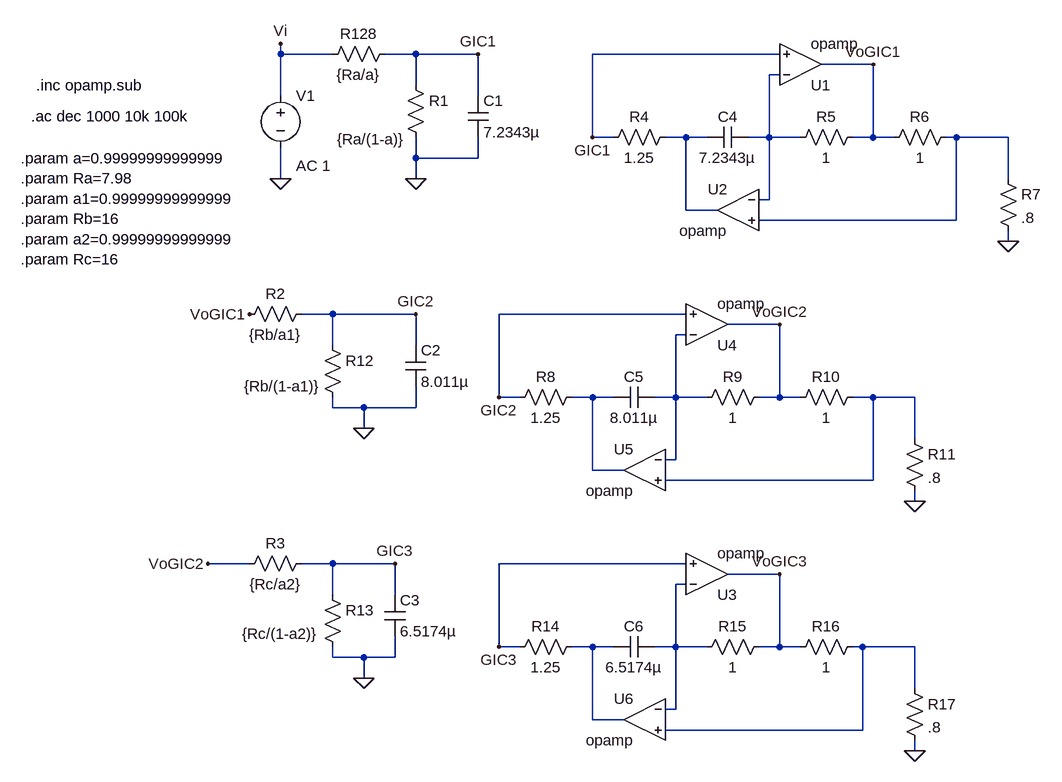
[diagram p0: schematic TS6_ACTIVADO.asc]
TS6_ACTIVADO.asc, the LTspice schematic file:
Version 4
SHEET 1 1540 1188
WIRE -112 96 -112 80
WIRE -32 96 -112 96
WIRE 96 96 48 96
WIRE 192 96 96 96
WIRE 656 96 368 96
WIRE 800 112 720 112
WIRE 656 128 640 128
WIRE 96 144 96 96
WIRE -112 160 -112 96
WIRE 192 160 192 96
WIRE 368 224 368 96
WIRE 400 224 368 224
WIRE 512 224 480 224
WIRE 544 224 512 224
WIRE 640 224 640 128
WIRE 640 224 608 224
WIRE 688 224 640 224
WIRE 800 224 800 112
WIRE 800 224 768 224
WIRE 832 224 800 224
WIRE 928 224 912 224
WIRE 1008 224 928 224
WIRE 96 256 96 224
WIRE 192 256 192 224
WIRE 192 256 96 256
WIRE -112 288 -112 240
WIRE 96 288 96 256
WIRE 1008 288 1008 224
WIRE 640 320 640 224
WIRE 640 320 624 320
WIRE 512 336 512 224
WIRE 560 336 512 336
WIRE 928 352 928 224
WIRE 928 352 624 352
WIRE 1008 384 1008 368
WIRE -32 496 -80 496
WIRE 96 496 -32 496
WIRE 512 496 224 496
WIRE 656 512 576 512
WIRE 512 528 496 528
WIRE -32 544 -32 496
WIRE 96 544 96 496
WIRE 224 624 224 496
WIRE 256 624 224 624
WIRE 368 624 336 624
WIRE 400 624 368 624
WIRE 496 624 496 528
WIRE 496 624 464 624
WIRE 544 624 496 624
WIRE 656 624 656 512
WIRE 656 624 624 624
WIRE 688 624 656 624
WIRE 800 624 768 624
WIRE 864 624 800 624
WIRE -32 640 -32 624
WIRE 16 640 -32 640
WIRE 96 640 96 608
WIRE 96 640 16 640
WIRE 16 672 16 640
WIRE 864 688 864 624
WIRE 496 720 496 624
WIRE 496 720 480 720
WIRE 368 736 368 624
WIRE 416 736 368 736
WIRE 800 752 800 624
WIRE 800 752 480 752
WIRE 864 784 864 768
WIRE -160 880 -224 880
WIRE -32 880 -80 880
WIRE 64 880 -32 880
WIRE 512 880 224 880
WIRE 656 896 576 896
WIRE 512 912 496 912
WIRE -32 928 -32 880
WIRE 64 928 64 880
WIRE 224 1008 224 880
WIRE 256 1008 224 1008
WIRE 368 1008 336 1008
WIRE 400 1008 368 1008
WIRE 496 1008 496 912
WIRE 496 1008 464 1008
WIRE 544 1008 496 1008
WIRE 656 1008 656 896
WIRE 656 1008 624 1008
WIRE 688 1008 656 1008
WIRE 784 1008 768 1008
WIRE 864 1008 784 1008
WIRE -32 1024 -32 1008
WIRE 16 1024 -32 1024
WIRE 64 1024 64 992
WIRE 64 1024 16 1024
WIRE 16 1056 16 1024
WIRE 864 1072 864 1008
WIRE 496 1104 496 1008
WIRE 496 1104 480 1104
WIRE 368 1120 368 1008
WIRE 416 1120 368 1120
WIRE 784 1136 784 1008
WIRE 784 1136 480 1136
WIRE 864 1168 864 1152
FLAG -112 80 Vi
FLAG 16 672 0
FLAG 16 1056 0
FLAG -112 288 0
FLAG 96 288 0
FLAG 1008 384 0
FLAG 368 224 GIC1
FLAG 192 96 GIC1
FLAG 800 112 VoGIC1
FLAG -160 496 VoGIC1
FLAG 864 784 0
FLAG 224 624 GIC2
FLAG 656 512 VoGIC2
FLAG 96 496 GIC2
FLAG 864 1168 0
FLAG 224 1008 GIC3
FLAG 656 896 VoGIC3
FLAG -224 880 VoGIC2
FLAG 64 880 GIC3
SYMBOL res 64 80 R90
WINDOW 0 0 56 VBottom 2
WINDOW 3 32 56 VTop 2
SYMATTR InstName R128
SYMATTR Value {Ra/a}
SYMBOL cap 176 160 R0
SYMATTR InstName C1
SYMATTR Value 7.2343µ
SYMBOL res -64 480 R90
WINDOW 0 0 56 VBottom 2
WINDOW 3 32 56 VTop 2
SYMATTR InstName R2
SYMATTR Value {Rb/a1}
SYMBOL cap 80 544 R0
SYMATTR InstName C2
SYMATTR Value 8.011µ
SYMBOL res -64 864 R90
WINDOW 0 0 56 VBottom 2
WINDOW 3 32 56 VTop 2
SYMATTR InstName R3
SYMATTR Value {Rc/a2}
SYMBOL cap 48 928 R0
SYMATTR InstName C3
SYMATTR Value 6.5174µ
SYMBOL voltage -112 144 R0
WINDOW 123 24 124 Left 2
WINDOW 39 0 0 Left 2
SYMATTR Value2 AC 1
SYMATTR InstName V1
SYMATTR Value ""
SYMBOL res 80 128 R0
WINDOW 3 -105 99 Left 2
SYMATTR Value {Ra/(1-a)}
SYMATTR InstName R1
SYMBOL Opamps\\opamp 688 176 M180
SYMATTR InstName U1
SYMBOL Opamps\\opamp 592 272 M0
SYMATTR InstName U2
SYMBOL res 496 208 R90
WINDOW 0 0 56 VBottom 2
WINDOW 3 32 56 VTop 2
SYMATTR InstName R4
SYMATTR Value 1.25
SYMBOL res 784 208 R90
WINDOW 0 0 56 VBottom 2
WINDOW 3 32 56 VTop 2
SYMATTR InstName R5
SYMATTR Value 1
SYMBOL res 928 208 R90
WINDOW 0 0 56 VBottom 2
WINDOW 3 32 56 VTop 2
SYMATTR InstName R6
SYMATTR Value 1
SYMBOL cap 608 208 R90
WINDOW 0 0 32 VBottom 2
WINDOW 3 32 32 VTop 2
SYMATTR InstName C4
SYMATTR Value 7.2343µ
SYMBOL res 992 272 R0
SYMATTR InstName R7
SYMATTR Value .8
SYMBOL Opamps\\opamp 544 576 M180
SYMATTR InstName U4
SYMBOL Opamps\\opamp 448 672 M0
SYMATTR InstName U5
SYMBOL res 352 608 R90
WINDOW 0 0 56 VBottom 2
WINDOW 3 32 56 VTop 2
SYMATTR InstName R8
SYMATTR Value 1.25
SYMBOL res 640 608 R90
WINDOW 0 0 56 VBottom 2
WINDOW 3 32 56 VTop 2
SYMATTR InstName R9
SYMATTR Value 1
SYMBOL res 784 608 R90
WINDOW 0 0 56 VBottom 2
WINDOW 3 32 56 VTop 2
SYMATTR InstName R10
SYMATTR Value 1
SYMBOL cap 464 608 R90
WINDOW 0 0 32 VBottom 2
WINDOW 3 32 32 VTop 2
SYMATTR InstName C5
SYMATTR Value 8.011µ
SYMBOL res 848 672 R0
SYMATTR InstName R11
SYMATTR Value .8
SYMBOL res -48 528 R0
WINDOW 3 -120 79 Left 2
SYMATTR Value {Rb/(1-a1)}
SYMATTR InstName R12
SYMBOL res -48 912 R0
WINDOW 3 -123 76 Left 2
SYMATTR Value {Rc/(1-a2)}
SYMATTR InstName R13
SYMBOL Opamps\\opamp 544 960 M180
SYMATTR InstName U3
SYMBOL Opamps\\opamp 448 1056 M0
SYMATTR InstName U6
SYMBOL res 352 992 R90
WINDOW 0 0 56 VBottom 2
WINDOW 3 32 56 VTop 2
SYMATTR InstName R14
SYMATTR Value 1.25
SYMBOL res 640 992 R90
WINDOW 0 0 56 VBottom 2
WINDOW 3 32 56 VTop 2
SYMATTR InstName R15
SYMATTR Value 1
SYMBOL res 784 992 R90
WINDOW 0 0 56 VBottom 2
WINDOW 3 32 56 VTop 2
SYMATTR InstName R16
SYMATTR Value 1
SYMBOL cap 464 992 R90
WINDOW 0 0 32 VBottom 2
WINDOW 3 32 32 VTop 2
SYMATTR InstName C6
SYMATTR Value 6.5174µ
SYMBOL res 848 1056 R0
SYMATTR InstName R17
SYMATTR Value .8
TEXT -488 144 Left 2 !.inc opamp.sub
TEXT -496 192 Left 2 !.ac dec 1000 10k 100k
TEXT -512 256 Left 2 !.param a=0.99999999999999\n.param Ra=7.98\n.param a1=0.99999999999999\n.param Rb=16\n.param a2=0.99999999999999\n.param Rc=16

The netlist it stands for:
* TS6_ACTIVADO.asc
R128 GIC1 Vi {Ra/a}
C1 GIC1 0 7.2343µ
R2 GIC2 VoGIC1 {Rb/a1}
C2 GIC2 0 8.011µ
R3 GIC3 VoGIC2 {Rc/a2}
C3 GIC3 0 6.5174µ
V1 Vi 0 AC 1
R1 GIC1 0 {Ra/(1-a)}
XU1 N001 GIC1 VoGIC1 opamp Aol=100K GBW=10Meg  ; pins invin noninvin out
XU2 N001 N003 N002 opamp Aol=100K GBW=10Meg  ; pins invin noninvin out
R4 N002 GIC1 1.25
R5 VoGIC1 N001 1
R6 N003 VoGIC1 1
C4 N001 N002 7.2343µ
R7 N003 0 .8
XU4 N004 GIC2 VoGIC2 opamp Aol=100K GBW=10Meg  ; pins invin noninvin out
XU5 N004 N006 N005 opamp Aol=100K GBW=10Meg  ; pins invin noninvin out
R8 N005 GIC2 1.25
R9 VoGIC2 N004 1
R10 N006 VoGIC2 1
C5 N004 N005 8.011µ
R11 N006 0 .8
R12 GIC2 0 {Rb/(1-a1)}
R13 GIC3 0 {Rc/(1-a2)}
XU3 N007 GIC3 VoGIC3 opamp Aol=100K GBW=10Meg  ; pins invin noninvin out
XU6 N007 N009 N008 opamp Aol=100K GBW=10Meg  ; pins invin noninvin out
R14 N008 GIC3 1.25
R15 VoGIC3 N007 1
R16 N009 VoGIC3 1
C6 N007 N008 6.5174µ
R17 N009 0 .8
.inc opamp.sub
.ac dec 1000 10k 100k
.param a=0.99999999999999
.param Ra=7.98
.param a1=0.99999999999999
.param Rb=16
.param a2=0.99999999999999
.param Rc=16
.backanno
.end

* Results of the author's LTspice run, read from the files saved beside the schematic
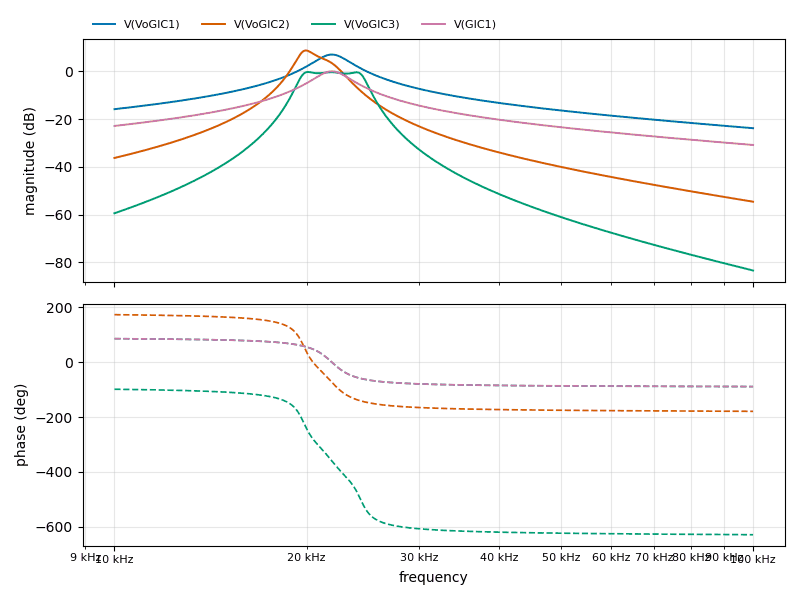
[diagram p1: AC Analysis of TS6_ACTIVADO.asc, plotted from the saved traces]
* AC Analysis, 1 run:
*   V(VoGIC1): -15.82 dB at 10 kHz, -23.78 dB at 100 kHz, peak 7.08 dB at 21.88 kHz, 3 dB below the peak at 20.58 kHz and 23.31 kHz
*   V(VoGIC2): -36.25 dB at 10 kHz, -54.57 dB at 100 kHz, peak 8.79 dB at 19.95 kHz, 3 dB below the peak at 19.39 kHz and 21.03 kHz
*   V(VoGIC3): -59.41 dB at 10 kHz, -83.39 dB at 100 kHz, peak -0.23 dB at 20.09 kHz, 3 dB below the peak at 19.5 kHz and 24.64 kHz
*   V(GIC1): -22.84 dB at 10 kHz, -30.80 dB at 100 kHz, peak 0.06 dB at 21.88 kHz, 3 dB below the peak at 20.58 kHz and 23.31 kHz